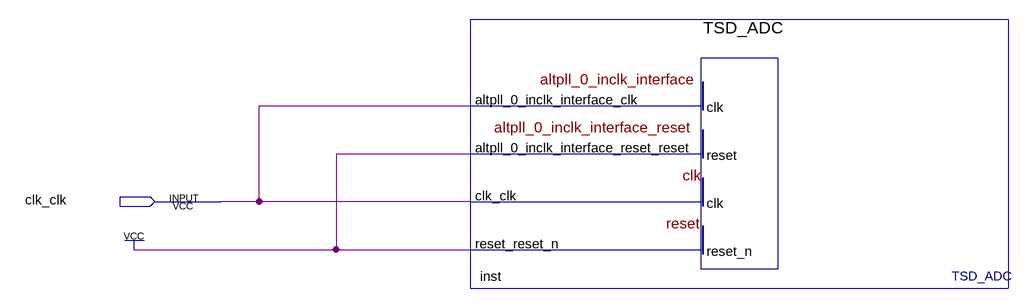
[diagram p0: schematic sheet]
// Quartus schematic MAX10_TSD.bdf as structural Verilog: 1 symbols, 1 pins
module MAX10_TSD (
  input  clk_clk
);

  TSD_ADC inst (
    .altpll_0_inclk_interface_clk(clk_clk), .altpll_0_inclk_interface_reset_reset(1'b1), .clk_clk(clk_clk),
    .reset_reset_n(1'b1));
endmodule
